# EAGLE design cap_pcb (EAGLE 9.6.2)
Assembly variants: basic
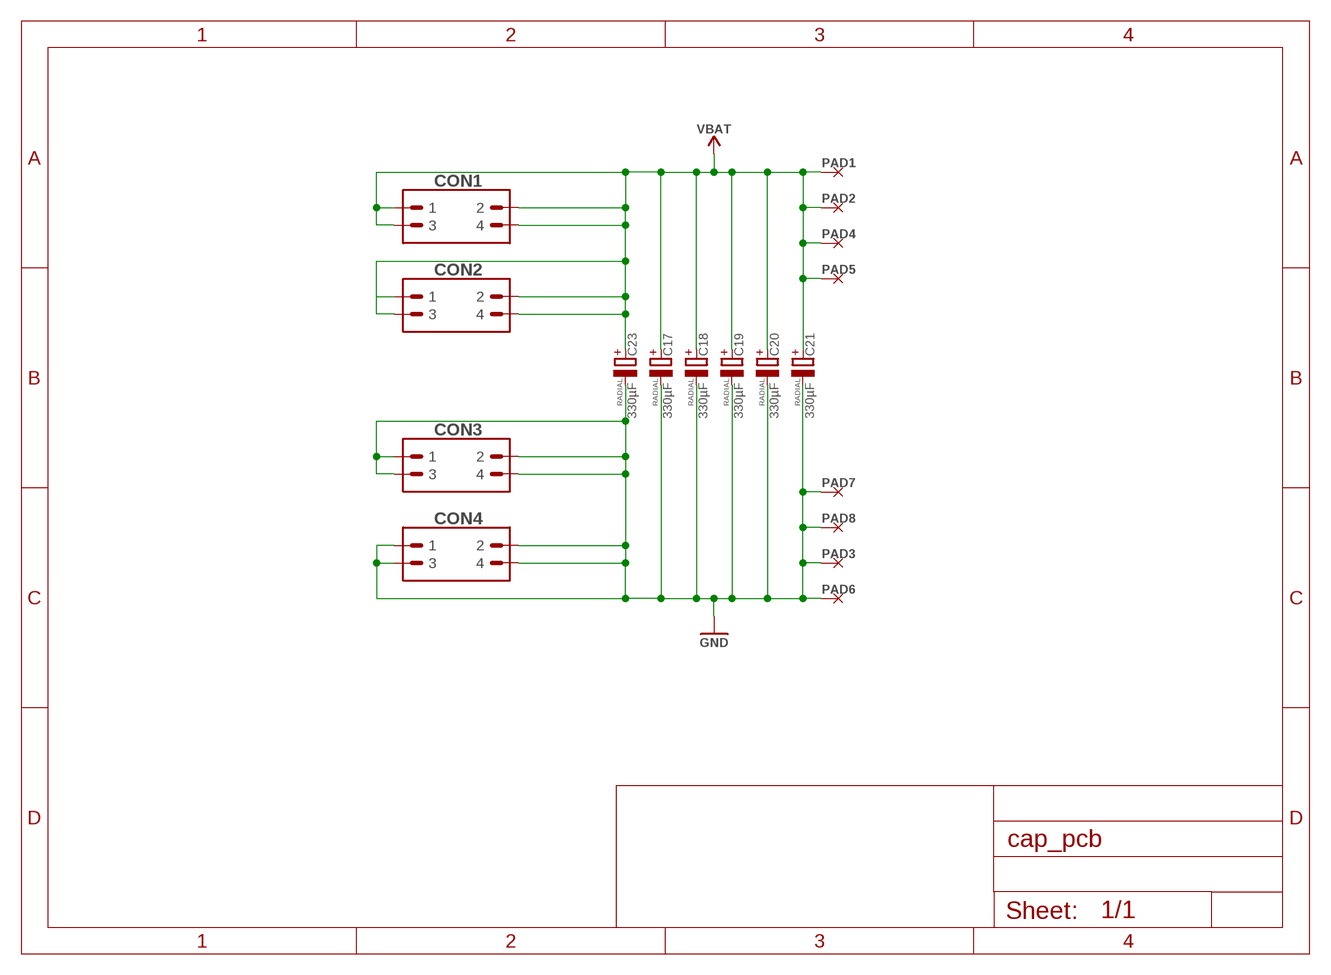
[diagram p0: schematic, sheet 1]

## Parts
C17  330µF  CPOL-RADIAL_SIDE-12.5-22  [RADIAL_SIDE_12.5X22]
C18  330µF  CPOL-RADIAL_SIDE-12.5-22  [RADIAL_SIDE_12.5X22]
C19  330µF  CPOL-RADIAL_SIDE-12.5-22  [RADIAL_SIDE_12.5X22]
C20  330µF  CPOL-RADIAL_SIDE-12.5-22  [RADIAL_SIDE_12.5X22]
C21  330µF  CPOL-RADIAL_SIDE-12.5-22  [RADIAL_SIDE_12.5X22]
C23  330µF  CPOL-RADIAL_SIDE-12.5-22  [RADIAL_SIDE_12.5X22]
CON1  PINHEAD_2X02-PTH-2.54-MALE  [2X02-PTH-2.54]  (not fitted in variant basic)
CON2  PINHEAD_2X02-PTH-2.54-MALE  [2X02-PTH-2.54]  (not fitted in variant basic)
CON3  PINHEAD_2X02-PTH-2.54-MALE  [2X02-PTH-2.54]  (not fitted in variant basic)
CON4  PINHEAD_2X02-PTH-2.54-MALE  [2X02-PTH-2.54]  (not fitted in variant basic)
PAD1  PAD-5X4  [5X4]  (not fitted in variant basic)
PAD2  PAD-5X4  [5X4]  (not fitted in variant basic)
PAD3  PAD-5X4  [5X4]  (not fitted in variant basic)
PAD4  PAD-5X4  [5X4]  (not fitted in variant basic)
PAD5  PAD-5X4  [5X4]  (not fitted in variant basic)
PAD6  PAD-5X4  [5X4]  (not fitted in variant basic)
PAD7  PAD-5X4  [5X4]  (not fitted in variant basic)
PAD8  PAD-5X4  [5X4]  (not fitted in variant basic)

## Nets
GND: C17.- C18.- C19.- C20.- C21.- C23.- CON3.1 CON3.2 CON3.3 CON3.4 CON4.1 CON4.2 CON4.3 CON4.4 PAD3.P$1 PAD6.P$1 PAD7.P$1 PAD8.P$1
VBAT [HV]: C17.+ C18.+ C19.+ C20.+ C21.+ C23.+ CON1.1 CON1.2 CON1.3 CON1.4 CON2.1 CON2.2 CON2.3 CON2.4 PAD1.P$1 PAD2.P$1 PAD4.P$1 PAD5.P$1

## Library data of the parts
C17-C21 C23 = rc:CPOL: Polar tantalum capacitor; DIGIKEY#: 493-4784-3-ND; MANF: Nichicon; MANF#: UCY2C101MHD1TO; PACKAGE: RADIAL; VOLTAGE: 160V
CON1-CON4 = pinhead:PINHEAD_2X02
PAD1-PAD8 = PADS:PAD; BOM: EXCLUDE

## Net classes
1 HV: clearance 0.5 mm to class 0, clearance 0.5 mm

## Board
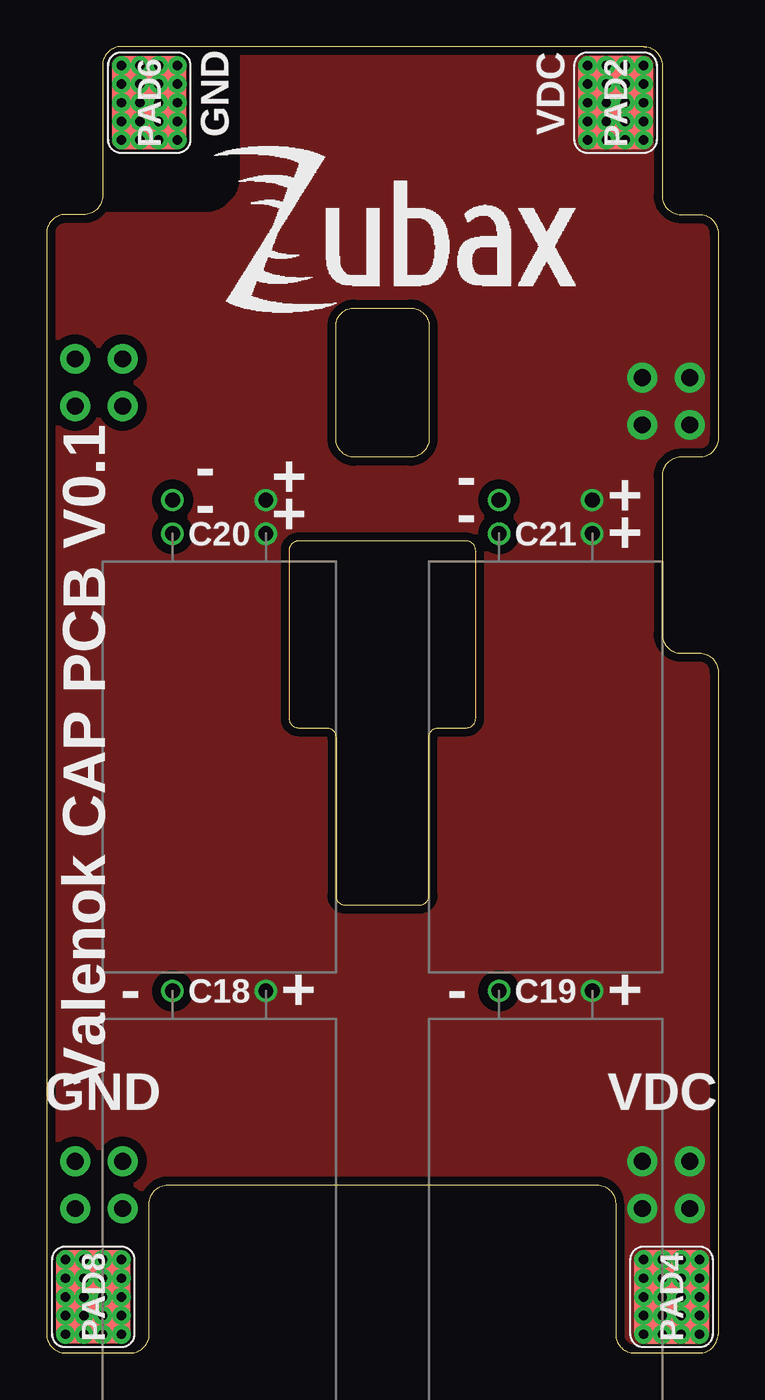
[diagram p1: board, top side]
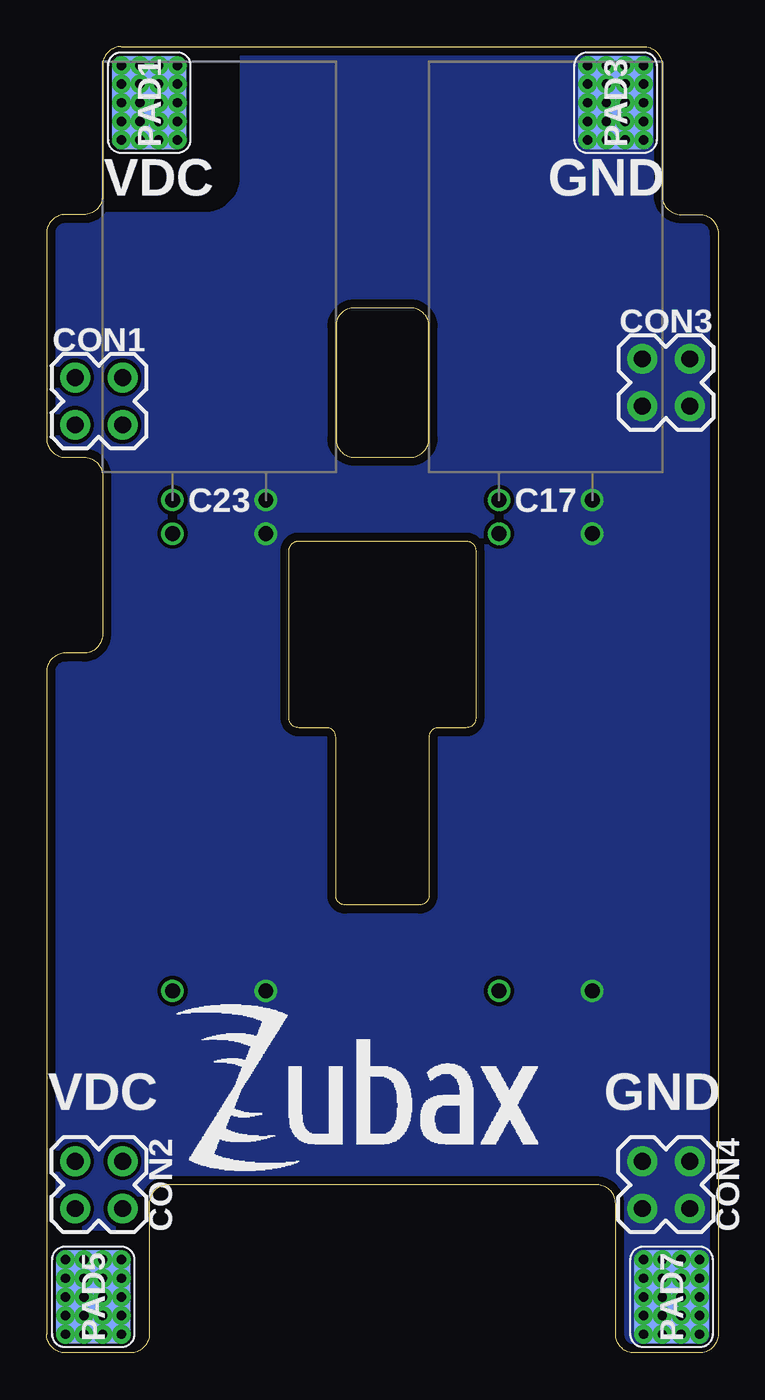
[diagram p2: board, bottom side, seen from below]

Size 36 x 70 mm. Coordinates in mm from the lower left corner, seen from the top.
Outline: 3,69 3,62 arc-90 2,61 1,61 arc90 0,60 0,1 arc90 1,0 4.5,0 arc90 5.5,1 5.5,8 arc-90 6.5,9 29.5,9 arc-90 30.5,8 30.5,1 arc90 31.5,0 35,0 arc90 36,1 36,36.5 arc90 35,37.5 34,37.5 arc-90 33,38.5 33,47 arc-90 34,48 35,48 arc90 36,49 36,60 arc90 35,61 34,61 arc-90 33,62 33,69 arc90 32,70 4,70 arc90 3,69
Outline: 15.5,33 15.5,24.5 arc90 16,24 20,24 arc90 20.5,24.5 20.5,33 arc-90 21,33.5 22.5,33.5 arc90 23,34 23,43 arc90 22.5,43.5 13.5,43.5 arc90 13,43 13,34 arc90 13.5,33.5 15,33.5 arc-90 15.5,33
Outline: 16.5,56 19.5,56 arc-90 20.5,55 20.5,49 arc-90 19.5,48 16.5,48 arc-90 15.5,49 15.5,55 arc-90 16.5,56
Copper layers (1*16): Top 0.035mm / dielectric 1mm / Bottom 0.035mm
Design rules "logicpcb *": minimum track width 0.2mm, minimum drill 0.2mm, track to track 0.2mm, track to pad 0.2mm, pad to pad 0.2mm, via to via 0.2mm, smd to smd 0.15mm, copper to edge 0.45mm, drill to drill 0.2mm, minimum pad ring 0.125mm, minimum via ring 0.125mm, stop-mask expansion 1mil, vias tented up to drill 0.31mm, thermal gap 8mil

### Footprints (pad centres in the part's own frame; a part is rotated, then mirrored left to right if it is on the bottom)
RADIAL_SIDE_12.5X22 = drill 0.8: + -2.5,0; - 2.5,0
2X02-PTH-2.54 = drill 0.9 pad 1.6: 1 -1.27,1.27; 2 1.27,1.27; 3 -1.27,-1.27; 4 1.27,-1.27
5X4 = smd 5 x 4: P$1 0,0

### Placement (x,y rotation side)
C17  9.25,45.7 0 bottom
C18  9.25,19.4 180 top
C19  26.75,19.4 180 top
C20  9.25,43.9 180 top
C21  26.75,43.9 180 top
C23  26.75,45.7 0 bottom
CON1  33.2,51 90 bottom
CON2  33.2,9 0 bottom
CON3  2.8,52 90 bottom
CON4  2.8,9 0 bottom
PAD1  30.5,67 270 bottom
PAD2  30.5,67 90 top
PAD3  5.5,67 270 bottom
PAD4  33.5,3 90 top
PAD5  33.5,3 270 bottom
PAD6  5.5,67 90 top
PAD7  2.5,3 270 bottom
PAD8  2.5,3 90 top
U$1  [ZUBAX_20X9]  29.5,9.5 0 bottom
U$3  [ZUBAX_20X9]  8.5,55.5 0 top

### Tracks (layer width: path | path; a pad name or v marks a point on that pad's centre or on a via)
GND  (via drill 0.5 pad 1)  (2 unrouted)
  other vias: 4,69 5,69 6,69 7,69 7,68 6,68 5,68 4,68 4,67 5,67 6,67 7,67 7,66 6,66 5,66 4,66 4,65 5,65 6,65 7,65 1,5 2,5 3,5 4,5 4,4 3,4 2,4 1,4 1,3 2,3 3,3 4,3 4,2 3,2 2,2 1,2 1,1 2,1 3,1 4,1
  pour Bottom (no thermals): 36,6.7 6,6.7 arc90 5,5.7 5,0 0,0 0,70 25.5,70 25.5,63 arc90 27.5,61 36,61
VBAT  (via drill 0.5 pad 1)  (2 unrouted)
  other vias: 32,5 33,5 34,5 35,5 35,4 34,4 33,4 32,4 32,3 33,3 34,3 35,3 35,2 34,2 33,2 32,2 32,1 33,1 34,1 35,1 29,69 30,69 31,69 32,69 32,68 31,68 30,68 29,68 29,67 30,67 31,67 32,67 32,66 31,66 30,66 29,66 29,65 30,65 31,65 32,65
  pour Top (no thermals): 0,6.7 30,6.7 arc-90 31,5.7 31,0 36,0 36,70 10.5,70 10.5,63 arc-90 8.5,61 0,61

### Text on the board
tPlace: GND | VDC | - | + | - | - | + | + | - | + | Valenok CAP PCB V0.1 | - | + | - | + | GND | VDC
bPlace: GND | VDC | GND | VDC